# Altium project BSPD_SMD.PrjPcb
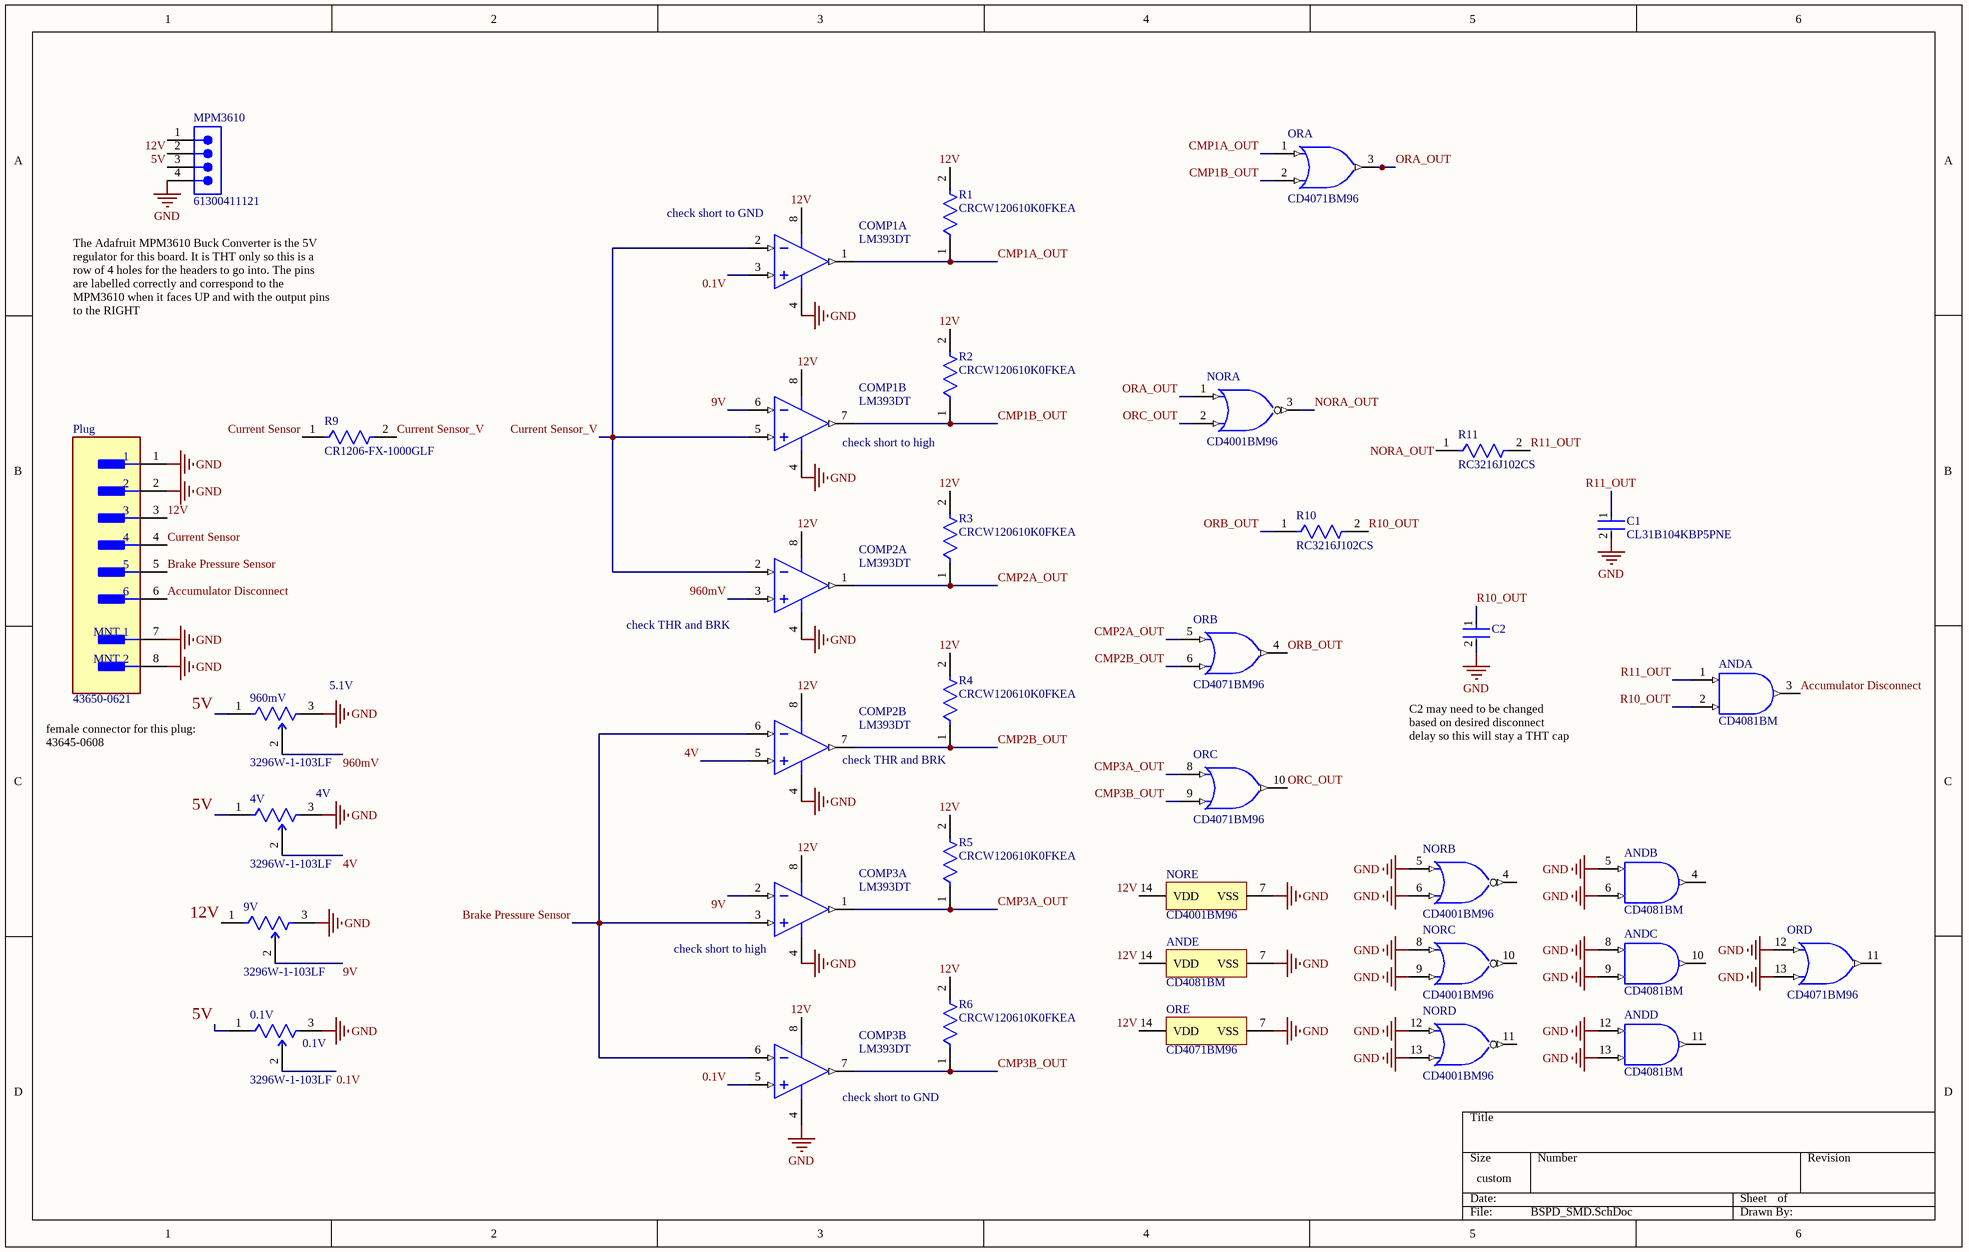
[diagram p0: BSPD_SMD.SchDoc]
1 sheet, 23 parts. Net scope: global (net labels, ports and power ports of the same name join across sheets).
Board file: BSPD_SMD.PcbDoc

## Sheet BSPD_SMD.SchDoc
size 368 x 233 mm; SheetNumber: 1; SheetTotal: 1

### Parts
0.1V  3296W-1-103LF  [FP-3296W-MFG]
4V  3296W-1-103LF  [FP-3296W-MFG]
9V  3296W-1-103LF  [FP-3296W-MFG]
960mV  3296W-1-103LF  [FP-3296W-MFG]
AND  CD4081BM  [D0014A_L]  (parts A,B,C,D,E of 5)
C1  CL31B104KBP5PNE  [FP-CL31-IPC_B]
C2  RDER71H105K2M1H03A  [FP-RDE2M1-MFG]  (value not drawn)
COMP1  LM393DT  [STM-SO-8_D_L]  (parts A,B of 2)
COMP2  LM393DT  [STM-SO-8_D_L]  (parts A,B of 2)
COMP3  LM393DT  [STM-SO-8_D_L]  (parts A,B of 2)
MPM3610  61300411121  [61300411121]
NOR  CD4001BM96  [D0014A_L]  (parts A,B,C,D,E of 5)
OR  CD4071BM96  [D0014A_M]  (parts A,B,C,D,E of 5)
Plug  43650-0621  [FP-43650-0621-MFG]
R1  CRCW120610K0FKEA  [FP-CRCW1206-e3-IPC_C]
R2  CRCW120610K0FKEA  [FP-CRCW1206-e3-IPC_C]
R3  CRCW120610K0FKEA  [FP-CRCW1206-e3-IPC_C]
R4  CRCW120610K0FKEA  [FP-CRCW1206-e3-IPC_C]
R5  CRCW120610K0FKEA  [FP-CRCW1206-e3-IPC_C]
R6  CRCW120610K0FKEA  [FP-CRCW1206-e3-IPC_C]
R9  CR1206-FX-1000GLF  [FP-CR1206-IPC_A]
R10  RC3216J102CS  [FP-RC3216-MFG]
R11  RC3216J102CS  [FP-RC3216-MFG]

### Nets
GND: 0.1V.3(CW) 4V.3(CW) 9V.3(CW) 960mV.3(CW) AND.5(C) AND.6(D) AND.7(VSS) AND.8(E) AND.9(F) AND.12(G) AND.13(H) C1.2 C2.2 COMP1.4(VCC-) COMP2.4(VCC-) COMP3.4(VCC-) MPM3610.4 NOR.5(C) NOR.6(D) NOR.7(VSS) NOR.8(E) NOR.9(F) NOR.12(G) NOR.13(H) OR.7(VSS) OR.12(G) OR.13(H) Plug.1 Plug.2 Plug.7(MNT_1) Plug.8(MNT_2)
0.1V: 0.1V.2(WIPER) COMP1.3(IN1+) COMP3.5(IN2+)
4V: 4V.2(WIPER) COMP2.5(IN2+)
5V: 0.1V.1(CCW) 4V.1(CCW) 960mV.1(CCW) MPM3610.3
9V: 9V.2(WIPER) COMP1.6(IN2-) COMP3.2(IN1-)
12V: 9V.1(CCW) AND.14(VDD) COMP1.8(VCC+) COMP3.8(VCC+) MPM3610.2 NOR.14(VDD) OR.14(VDD) Plug.3 R1.2 R2.2 R3.2 R4.2 R5.2 R6.2
960mV: 960mV.2(WIPER) COMP2.3(IN1+)
Accumulator Disconnect: AND.3(J) Plug.6
Brake Pressure Sensor: COMP2.6(IN2-) COMP3.3(IN1+) COMP3.6(IN2-) Plug.5
CMP1A_OUT: COMP1.1(OUT1) OR.1(A) R1.1
CMP1B_OUT: COMP1.7(OUT2) OR.2(B) R2.1
CMP2A_OUT: COMP2.1(OUT1) OR.5(C) R3.1
CMP2B_OUT: COMP2.7(OUT2) OR.6(D) R4.1
CMP3A_OUT: COMP3.1(OUT1) OR.8(E) R5.1
CMP3B_OUT: COMP3.7(OUT2) OR.9(F) R6.1
Current Sensor: Plug.4 R9.1
Current Sensor_V: COMP1.2(IN1-) COMP1.5(IN2+) COMP2.2(IN1-) R9.2
NORA_OUT: NOR.3(J) R11.1
ORA_OUT: NOR.1(A) OR.3(J)
ORB_OUT: OR.4(K) R10.1
ORC_OUT: NOR.2(B) OR.10(L)
R10_OUT: AND.2(B) C2.1 R10.2
R11_OUT: AND.1(A) C1.1 R11.2

Not connected (* = marked no-connect by the designer): AND 4(K) 10(L) 11(M); COMP2 8(VCC+); MPM3610 1; NOR 4(K) 10(L) 11(M); OR 11(M)

### Notes on the sheet
- (near COMP1) check short to GND
- The Adafruit MPM3610 Buck Converter is the 5V regulator for this board. It is THT only so this is a row of 4 holes for the headers to go into. The pins are labelled correctly and correspond to the MPM3610 when it faces UP and with the output pins to the RIGHT
- (near COMP1) check short to high
- (near COMP2) check THR and BRK
- (near 960mV) 5.1V
- female connector for this plug:
  43645-0608
- (near 4V) 4V
- C2 may need to be changed based on desired disconnect delay so this will stay a THT cap
- (near COMP3) check short to high
- (near 0.1V) 0.1V
- (near COMP3) check short to GND
- Labels drawn without touching a wire or pin: 12V

### Library data of the parts
0.1V 4V 9V 960mV = CMP-1747-00001-8: TRIMMER 10K OHM 0.5W PC PIN TOP; Number of Turns: 25; Tolerance: 10%; Resistance: 10kR; Max Power Dissipation: 500mW; Temperature Coefficient: 100ppm/°C; Insulation Resistance: 1GR; Min Operating Temperature: -55°C; Resistor Type: Cermet; Series: 3296; Color: Blue; Mount: Through Hole; Taper: Linear; Radiation Hardening: No; RoHS Compliant: Yes; Width: 9.53mm; Resistance Tolerance: 10%; Contact Plating: Tin; Military Standard: Not; Package Quantity: 50; Weight: 0.03oz; Lead Free: Lead Free; Power Rating: 500mW; Termination: Pin; Technology: CERMET; Max Operating Temperature: 125°C; Packaging: Rail/Tube; Length: 9.53mm; Depth: 4.83mm; Height: 11.55mm; Reach SVHC Compliant: Yes
AND = CMP-0777-00097-3: CMOS Quad 2-Input AND Gate, D0014A, TUBE; Manufacturer: Texas Instruments; VCC(Max)(V): 18; tpd @ Nom Voltage(Max)(ns): 12; Output Drive (IOL/IOH)(Max)(mA): -6.8/6.8; F @ Nom Voltage(Max)(Mhz): 8; ICC @ Nom Voltage(Max)(mA): 0.015; Schmitt Trigger: No; Bits(#): 4; Rating: Military; VCC(Min)(V): 3; Voltage(Nom)(V): 10; Technology Family: CD4000; Output Type: CMOS; Operating Temperature Range(C): -55 to 125; DatasheetVersion: SCHS057C; PackageReference: D0014A; Input Type: CMOS; Generic Part Number: CD4081B
C1 = CMP-13271-003837-1: Cap Ceramic 100nF 50V X7R ±10% SMD 1206 +125°C Embossed T/R; Packaging: Tape and Reel; Mount: Surface Mount; Thickness: 0.051inch; Ratings: AEC-Q200; Capacitance: 100nF; Features: Soft Termination; Case Code (Imperial): 1206; Package Quantity: 2000; Width: 0.063inch; Case/Package: 1206; Max Operating Temperature: 125°C; Length: 0.126inch; Case Code (Metric): 3216; Voltage Rating: 50V; Min Operating Temperature: -55°C; Tolerance: 10%
C2 = CMP-06035-045612-1: Ceramic Capacitor 1uF ±10% 50V X7R Radial; Lead Diameter: 0.5mm; Lead/Base Style: Kinked; Height - Seated (Max): 0.236inch; Tolerance: 10%; Height: 4mm; Package Quantity: 2000; Termination: Radial; Voltage Rating: 50V; Width: 4mm; Voltage Rating (DC): 50V; Lead Free: Lead Free; Case/Package: Radial; Length: 0.217inch; Mount: Through Hole; Dielectric: X7R; Packaging: Tape and Reel; Min Operating Temperature: -55°C; Max Operating Temperature: 125°C; Lead Pitch: 0.197inch; Capacitance: 1uF; Resistor Type: Ceramic
COMP1-COMP3 = CMP-2000-06550-1: Low-Power, Dual-Voltage Comparator, 2 to 36 V, 0 to 70 degC, 8-Pin SOIC (SO), RoHS, Tape and Reel; Manufacturer: STMicroelectronics; Voltage - Supply, Single/Dual (±): 2V~36V,±1V~18V; Current - Input Bias (Max): 0.25µA@5V; Number of Elements: 2; Current - Output (Typ): 18mA@5V; Other Names: 497-1593-2; Voltage - Input Offset (Max): 5mV@30V; Output Type: CMOS,DTL,ECL,MOS,Open-Collector,TTL; EDA / CAD Models: DownloadfromAcceleratedDesigns; Other Related Documents: LM393ViewAllSpecificationsLM393ViewAllSpecifications; Online Catalog: Comparators-2elements; Current - Quiescent (Max): 2.5mA; Standard Package: 2,500; Manufacturer URL: http://www.st.com/; Package Description: 8-Pin Small Outline Integrated Circuit, Body 4.9 x 3.9 mm, Pitch 1.27 mm; Packaging: Tape&Reel(TR); Datasheet Version: Rev. 15, 02/2016; Category: IntegratedCircuits(ICs); Operating Temperature: 0°C~70°C; Mounting Type: SurfaceMount; Supplier Device Package: 8-SO; Datasheet URL: http://www.st.com/content/ccc/resource/technical/document/datasheet/group1/b4/cc/cf/13/18/28/44/f5/CD00000465/files/CD00000465.pdf/jcr:content/translations/en.CD00000465.pdf; Family: Linear-Comparators; Mounting Technology: SurfaceMount; Type: GeneralPurpose; Package Reference: SO-8; Package / Case: 8-SOIC(0.154",3.90mmWidth)
MPM3610 = CMP-1502-01064-3: NexarPartId: 32855522; Operating Supply Voltage: 250V; Pitch: 2.54mm; Contact Resistance: 20mΩ; Number of Positions: 4; Current Rating: 3A; Connector Type: Male Pin; Gender: Male; Contact Plating: Gold; Height: 8.89mm; Lead Pitch: 2.54mm; Lead Free: Lead Free; Contact Mating Length: 5.9944mm; Number of Rows: 1; Termination: Solder; Packaging: Bulk; REACH SVHC: Unknown; Min Operating Temperature: -40°C; RoHS: Compliant; Number of Contacts: 4; Voltage Rating: 250V; Color: Black; Max Operating Temperature: 105°C; Contact Material: Copper; Mount: Through Hole; Orientation: Vertical; Number of Pins: 4
NOR = CMP-0806-00070-3: CMOS Quad 2-Input NOR Gate, D0014A, LARGE T&R; Manufacturer: Texas Instruments; tpd @ Nom Voltage(Max)(ns): 120; VCC(Min)(V): 3; VCC(Max)(V): 18; Voltage(Nom)(V): 10; Bits(#): 4; ICC @ Nom Voltage(Max)(mA): 0.015; Rating: Military; F @ Nom Voltage(Max)(Mhz): 8; Output Drive (IOL/IOH)(Max)(mA): 1.5/-1.5; Output Type: CMOS; Generic Part Number: CD4001B; PackageVersion: http://www.ti.com/lit/ml/mpds177g/mpds177g.pdf; Operating Temperature Range(C): -55 to 125; Code_JEDEC: MS-012; Input Type: CMOS; PackageReference: D0014A; DatasheetVersion: SCHS015C
OR = CMP-1573-00001-3: CMOS Quad 2-Input OR Gate, D0014A, LARGE T&R; Manufacturer: Texas Instruments; ICC @ Nom Voltage(Max)(mA): 0.015; Voltage(Nom)(V): 10; F @ Nom Voltage(Max)(Mhz): 8; tpd @ Nom Voltage(Max)(ns): 120; VCC(Min)(V): 3; Bits(#): 4; VCC(Max)(V): 18; Rating: Military; Output Drive (IOL/IOH)(Max)(mA): 1.5/-1.5; PackageReference: D0014A; Code_JEDEC: MS-012; Output Type: CMOS; PackageVersion: http://www.ti.com/lit/ml/mpds177g/mpds177g.pdf; Generic Part Number: CD4071B; Input Type: CMOS; DatasheetVersion: SCHS056D; Operating Temperature Range(C): -55 to 125
Plug = CMP-00257-07662232-1: 43650-0621 Header 3.00mm, SMT, single row, vert, 6w; Manufacturer Lifecycle Status: ACTIVE; Voltage Rating: 600V; Number of Positions: 6; Glow Wire Compliant: Compliant; Current Rating: 5A; Pitch: 3mm; Plating: Tin; Gender: Male; NexarPartId: 7662232; Halogen Free: Low Halogen; Orientation: Vertical; Number of Contacts: 6; Housing Material: Polymer; Number of Rows: 1; Number of Pins: 6; Termination: Solder; Contact Gender: Male; Number of Circuits: 6; Contact Material: Brass; Min Operating Temperature: -40°C; Contact Plating: Tin; RoHS: Compliant; Country of Origin: US; Lifecycle Status: Production; Mount: Surface Mount; Max Operating Temperature: 105°C
R1-R6 = CMP-2003-04807-2: RES Thick Film, 10kΩ, 1%, 0.25W, 100ppm/°C, 1206; Working Voltage: 200V; Max Power Dissipation: 250mW; Resistance: 10kR; Tolerance: 1%; Width: 0.063inch; Height: 0.55mm; Number of Pins: 2; Voltage Rating: 200V; Temperature Coefficient: 100ppm/°C; Military Standard: Not; Features: Automotive AEC-Q200; Depth: 1.6mm; Radiation Hardening: No; Termination: SMD/SMT; Case Code (Imperial): 1206; Weight: 0.000353oz; Length: 3.2mm; Package Quantity: 10; Voltage Rating (DC): 200V; Case/Package: 1206; Min Operating Temperature: -55°C; Number of Terminations: 2; Composition: Thick Film; Contact Plating: Tin; Power Rating: 250mW; Packaging: Tape and Reel; Max Operating Temperature: 155°C; Lead Free: Lead Free; Case Code (Metric): 3216
R9 = CMP-07231-000980-1: Thick Film Chip Resistors 1206 100Ω 0.25W 1% 100ppm/°C; Max Power Dissipation: 250mW; Voltage Rating: 200V; Resistance: 100R; Features: Moisture Resistant; Mount: Surface Mount; Composition: Thick Film; Contact Plating: Tin; Depth: 1.6mm; Number of Terminations: 2; Length: 0.126inch; Power Rating: 250mW; Temperature Coefficient: 100ppm/°C; Case Code (Metric): 3216; Radiation Hardening: No; Height: 0.03inch; Packaging: Tape and Reel; Height - Seated (Max): 0.03inch; Thickness: 610um; Case Code (Imperial): 1206; Package Quantity: 1; Tolerance: 1%; Max Operating Temperature: 155°C; Termination: SMD/SMT; Width: 0.063inch; Military Standard: Not; Case/Package: 1206; Min Operating Temperature: -55°C
R10 R11 = CMP-13261-001932-1: Res Thick Film 1206 1kΩ 5% 0.25W ±100ppm/°C Molded SMD T/R; Max Power Dissipation: 250mW; Resistance: 1kR; Voltage Rating (DC): 200V; Width: 0.063inch; Length: 0.126inch; Min Operating Temperature: -55°C; Packaging: Tape and Reel; Case Code (Metric): 3216; Contact Plating: Tin; Composition: Thick Film; Military Standard: Not; Depth: 1.6mm; Lead Free: Lead Free; Height: 0.026inch; Case Code (Imperial): 1206; Number of Terminations: 2; Radiation Hardening: No; Case/Package: 1206; Features: Moisture Resistant; Power Rating: 250mW; Max Operating Temperature: 155°C; Tolerance: 5%; Temperature Coefficient: 100ppm/°C